# Altium schematic sheet NANO_STM32F103_2.SchDoc
size A4
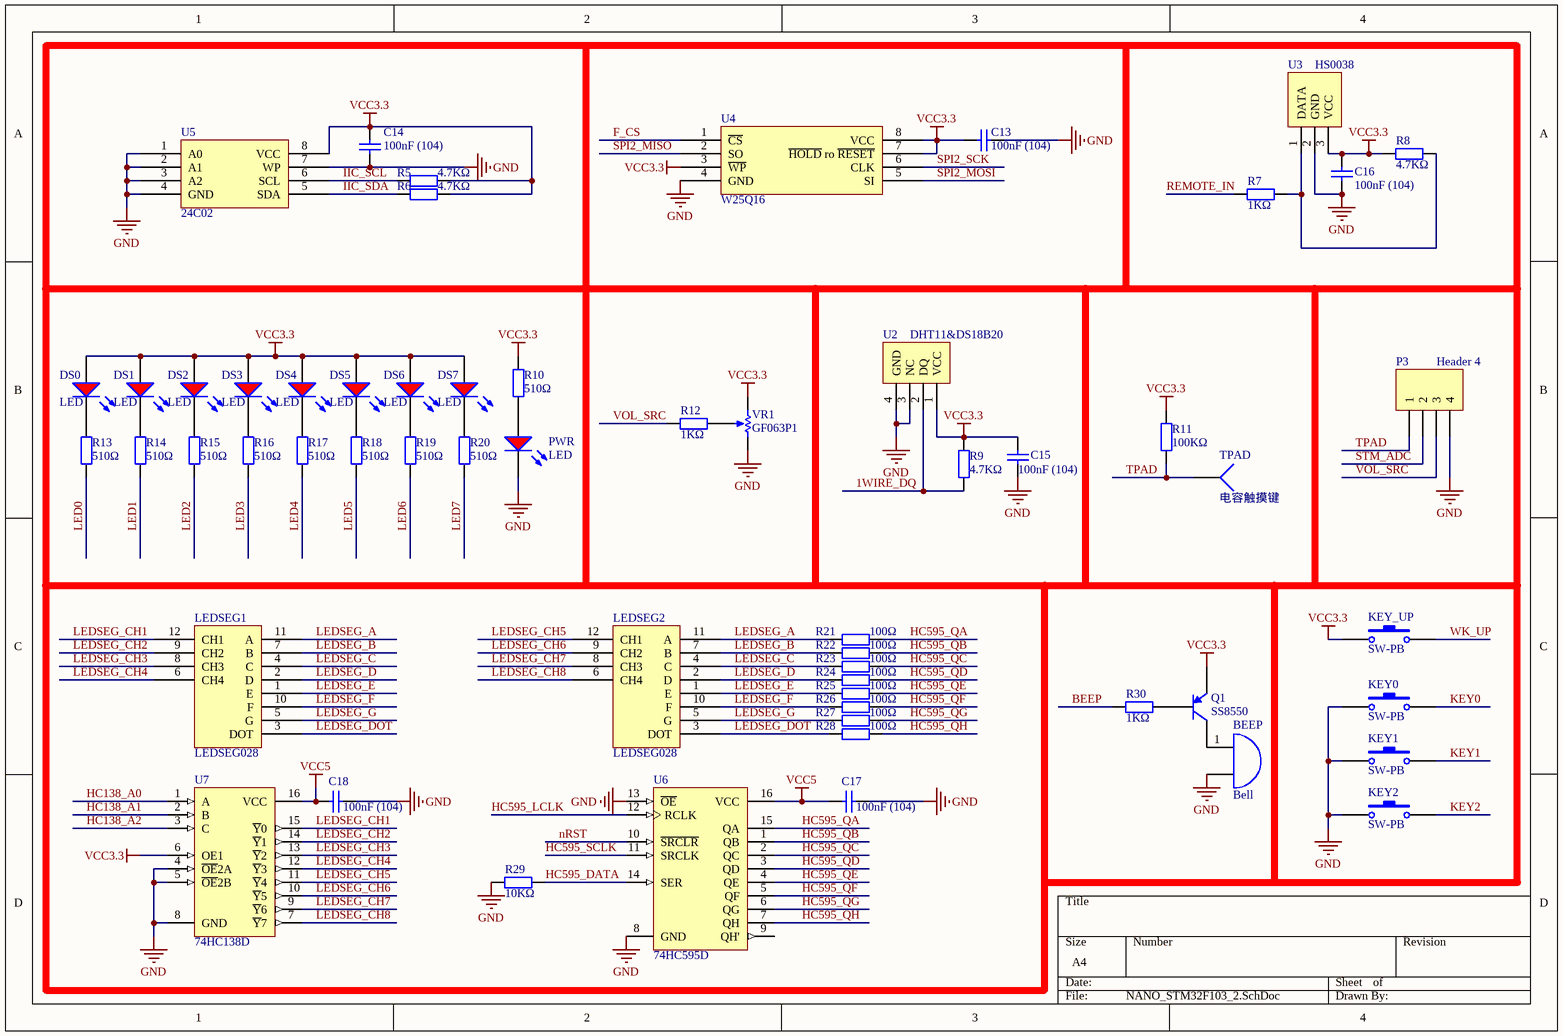
[diagram p0: NANO_STM32F103_2.SchDoc]

## Parts
BEEP  Bell  [PIN2]
C13  100nF (104)  [0603_C]
C14  100nF (104)  [0603_C]
C15  100nF (104)  [0603_C]
C16  100nF (104)  [0603_C]
C17  100nF (104)  [0603_C]
C18  100nF (104)  [0603_C]
DS0  LED  [0805_LED_S1]
DS1  LED  [0805_LED_S1]
DS2  LED  [0805_LED_S1]
DS3  LED  [0805_LED_S1]
DS4  LED  [0805_LED_S1]
DS5  LED  [0805_LED_S1]
DS6  LED  [0805_LED_S1]
DS7  LED  [0805_LED_S1]
KEY0  SW-PB  [SPST-2]
KEY1  SW-PB  [SPST-2]
KEY2  SW-PB  [SPST-2]
KEY_UP  SW-PB  [SPST-2]
LEDSEG1  LEDSEG028  [HDR1X12]
LEDSEG2  LEDSEG028  [HDR1X12]
P3  Header 4  [HDR1X4]
PWR  LED  [0805_LED_S1]
Q1  SS8550  [SOT-23(SOT-23-3)]
R5  4.7KΩ  [0603_R]
R6  4.7KΩ  [0603_R]
R7  1KΩ  [0603_R]
R8  4.7KΩ  [0603_R]
R9  4.7KΩ  [0603_R]
R10  510Ω  [0603_R]
R11  100KΩ  [0603_R]
R12  1KΩ  [0603_R]
R13  510Ω  [0603_R]
R14  510Ω  [0603_R]
R15  510Ω  [0603_R]
R16  510Ω  [0603_R]
R17  510Ω  [0603_R]
R18  510Ω  [0603_R]
R19  510Ω  [0603_R]
R20  510Ω  [0603_R]
R21  100Ω  [0603_R]
R22  100Ω  [0603_R]
R23  100Ω  [0603_R]
R24  100Ω  [0603_R]
R25  100Ω  [0603_R]
R26  100Ω  [0603_R]
R27  100Ω  [0603_R]
R28  100Ω  [0603_R]
R29  10KΩ  [0603_R]
R30  1KΩ  [0603_R]
TPAD  电容触摸键  [TPAD]
U2  DHT11&DS18B20  [DHT11&DS18B20]
U3  HS0038  [HS0038]
U4  W25Q16  [SOIC-8_208mil]
U5  24C02  [SOIC-8_150mil]
U6  74HC595D  [SOIC-16_150mil]
U7  74HC138D  [SOIC-16_150mil]
VR1  GF063P1  [VR5]

## Nets
GND: BEEP.2(B) C13.2 C14.1 C15.2 C16.2 C17.2 C18.2 KEY0.1 KEY1.1 KEY2.1 P3.4 PWR.K R29.1 U2.3(NC) U2.4(GND) U3.2(GND) U4.4(GND) U5.1(A0) U5.2(A1) U5.3(A2) U5.4(GND) U5.7(WP) U6.8(GND) U6.13(~{OE}) U7.4(~{OE}2A) U7.5(~{OE}2B) U7.8(GND) VR1.2(BOT)
VCC3.3: C13.1 C14.2 C15.1 C16.1 DS0.A DS1.A DS2.A DS3.A DS4.A DS5.A DS6.A DS7.A KEY_UP.1 Q1.2(E) R5.2 R6.2 R8.1 R9.2 R10.1 R11.1 U2.1(VCC) U3.3(VCC) U4.3(~{WP}) U4.7(~{HOLD}_ro_~{RESET}) U4.8(VCC) U5.8(VCC) U7.6(OE1) VR1.1(TOP)
VCC5: C17.1 C18.1 U6.16(VCC) U7.16(VCC)
1WIRE_DQ: R9.1 U2.2(DQ)
BEEP: R30.1
F_CS: U4.1(~{CS})
HC138_A0: U7.1(A)
HC138_A1: U7.2(B)
HC138_A2: U7.3(C)
HC595_DATA: R29.2 U6.14(SER)
HC595_LCLK: U6.12(RCLK)
HC595_QA: R21.2 U6.15(QA)
HC595_QB: R22.2 U6.1(QB)
HC595_QC: R23.2 U6.2(QC)
HC595_QD: R24.2 U6.3(QD)
HC595_QE: R25.2 U6.4(QE)
HC595_QF: R26.2 U6.5(QF)
HC595_QG: R27.2 U6.6(QG)
HC595_QH: R28.2 U6.7(QH)
HC595_SCLK: U6.11(SRCLK)
IIC_SCL: R5.1 U5.6(SCL)
IIC_SDA: R6.1 U5.5(SDA)
KEY0: KEY0.2
KEY1: KEY1.2
KEY2: KEY2.2
LED0: R13.2
LED1: R14.2
LED2: R15.2
LED3: R16.2
LED4: R17.2
LED5: R18.2
LED6: R19.2
LED7: R20.2
LEDSEG_A: LEDSEG1.11(A) LEDSEG2.11(A) R21.1
LEDSEG_B: LEDSEG1.7(B) LEDSEG2.7(B) R22.1
LEDSEG_C: LEDSEG1.4(C) LEDSEG2.4(C) R23.1
LEDSEG_CH1: LEDSEG1.12(CH1) U7.15(~{Y}0)
LEDSEG_CH2: LEDSEG1.9(CH2) U7.14(~{Y}1)
LEDSEG_CH3: LEDSEG1.8(CH3) U7.13(~{Y}2)
LEDSEG_CH4: LEDSEG1.6(CH4) U7.12(~{Y}3)
LEDSEG_CH5: LEDSEG2.12(CH1) U7.11(~{Y}4)
LEDSEG_CH6: LEDSEG2.9(CH2) U7.10(~{Y}5)
LEDSEG_CH7: LEDSEG2.8(CH3) U7.9(~{Y}6)
LEDSEG_CH8: LEDSEG2.6(CH4) U7.7(~{Y}7)
LEDSEG_D: LEDSEG1.2(D) LEDSEG2.2(D) R24.1
LEDSEG_DOT: LEDSEG1.3(DOT) LEDSEG2.3(DOT) R28.1
LEDSEG_E: LEDSEG1.1(E) LEDSEG2.1(E) R25.1
LEDSEG_F: LEDSEG1.10(F) LEDSEG2.10(F) R26.1
LEDSEG_G: LEDSEG1.5(G) LEDSEG2.5(G) R27.1
nRST: U6.10(~{SRCLR})
REMOTE_IN: R7.1
SPI2_MISO: U4.2(SO)
SPI2_MOSI: U4.5(SI)
SPI2_SCK: U4.6(CLK)
STM_ADC: P3.2
TPAD: P3.1 R11.2 TPAD.1
VOL_SRC: P3.3 R12.1
WK_UP: KEY_UP.2
NetBEEP_1: BEEP.1(A) Q1.3(C)
NetDS0_K: DS0.K R13.1
NetDS1_K: DS1.K R14.1
NetDS2_K: DS2.K R15.1
NetDS3_K: DS3.K R16.1
NetDS4_K: DS4.K R17.1
NetDS5_K: DS5.K R18.1
NetDS6_K: DS6.K R19.1
NetDS7_K: DS7.K R20.1
NetPWR_A: PWR.A R10.2
NetQ1_1: Q1.1(B) R30.2
NetR7_2: R7.2 R8.2 U3.1(DATA)
NetR12_2: R12.2 VR1.3(TAP)

Not connected (* = marked no-connect by the designer): U6 9(QH')

## Library data of the parts
BEEP = Bell: Electrical Bell; Published: 24-Mar-1999; LatestRevisionDate: 17-Jul-2002; LatestRevisionNote: Re-released for DXP Platform.; PackageReference: PIN2; Publisher: Altium Limited
C13-C18 = 0603 100nF (104) 10% 50V: 贴片电容; ComponentLink1Description: 供应商链接; ComponentLink1URL: http://www.szlcsc.com/product/details_15331.html; Package: 0603; Supplier: LC; SuppliersPartNumber: C14663
DS0-DS7 PWR = 0603 红灯: 发光二极管; ComponentLink1Description: 供应商链接; ComponentLink1URL: http://www.szlcsc.com/product/details_2659.html; Package: 0603; Supplier: LC; SuppliersPartNumber: C2286
KEY0-KEY2 KEY_UP = SW-PB: Switch; Published: 24-Mar-1999; LatestRevisionDate: 17-Jul-2002; LatestRevisionNote: Re-released for DXP Platform.; PackageReference: SPST-2; Publisher: Altium Limited; PackageDescription: Switch; 2 Leads
LEDSEG1 LEDSEG2 = LEDSEG028: 四位八段数码管_共阴极
P3 = Header 4: Header, 4-Pin; LatestRevisionDate: 17-Jul-2002; LatestRevisionNote: Re-released for DXP Platform.; Publisher: Altium Limited
Q1 = SOT-23 SS8550 Y2: PNP三极管; ComponentLink1Description: 供应商链接; ComponentLink1URL: http://www.szlcsc.com/product/details_9037.html; Package: SOT-23; Supplier: LC; SuppliersPartNumber: C8542
R5 R6 R8 R9 = 0603 4.7KΩ (4701) 1%: 贴片电阻; ComponentLink1Description: 供应商链接; ComponentLink1URL: http://www.szlcsc.com/product/details_23889.html; Package: 0603; Supplier: LC; SuppliersPartNumber: C23162
R7 R12 R30 = 0603 1KΩ (1001) 1%: 贴片电阻; ComponentLink1Description: 供应商链接; ComponentLink1URL: http://www.szlcsc.com/product/details_21904.html; Package: 0603; Supplier: LC; SuppliersPartNumber: C21190
R10 R13-R20 = 0603 510Ω (5100) 1%: 贴片电阻; ComponentLink1Description: 供应商链接; ComponentLink1URL: http://www.szlcsc.com/product/details_23920.html; Package: 0603; Supplier: LC; SuppliersPartNumber: C23193
R11 = 0603 100KΩ (1003) 1%: 贴片电阻; ComponentLink1Description: 供应商链接; ComponentLink1URL: http://www.szlcsc.com/product/details_26546.html; Package: 0603; Supplier: LC; SuppliersPartNumber: C25803
R21-R28 = 0603 100Ω (1000) 1%: 贴片电阻; ComponentLink1Description: 供应商链接; ComponentLink1URL: http://www.szlcsc.com/product/details_23502.html; Package: 0603; Supplier: LC; SuppliersPartNumber: C22775
R29 = 0603 10KΩ (1002) 1%: 贴片电阻; ComponentLink1Description: 供应商链接; ComponentLink1URL: http://www.szlcsc.com/product/details_26547.html; Package: 0603; Supplier: LC; SuppliersPartNumber: C25804
TPAD = Socket: LatestRevisionDate: 17-Jul-2002; LatestRevisionNote: Re-released for DXP Platform.; Publisher: Altium Limited
U2 = DHT11&DS18B20: DHT11或DS18B20_2.54mm
U3 = HS0038: HS0038_2.54mm
U4 = W25Q128FVSIG_[C35101]: Flash ROM; ComponentLink1Description: 供应商链接; ComponentLink1URL: http://www.szlcsc.com/product/details_36072.html; Package: SOIC-8; Supplier: LC; SuppliersPartNumber: C35101
U5 = CAN/TJA1050T/CM_[C6952]: ComponentLink1Description: 供应商链接; ComponentLink1URL: http://www.szlcsc.com/product/details_7424.html; Package: SOIC-8_150mil; Supplier: LC; SuppliersPartNumber: C6952
U6 = 74HC595D_[C5947]: 74系列逻辑芯片; ComponentLink1Description: 供应商链接; ComponentLink1URL: http://www.szlcsc.com/product/details_6413.html; Package: SOIC-16_150mil; Supplier: LC; SuppliersPartNumber: C5947
U7 = 74HC138D_[C5602]: 74系列逻辑芯片; ComponentLink1Description: 供应商链接; ComponentLink1URL: http://www.szlcsc.com/product/details_6053.html; Package: SOIC-16_150mil; Supplier: LC; SuppliersPartNumber: C5602
VR1 = RPot: 滑动变阻器; Sim Note: Enter the Resistance value and the set point into parameter fields.; Set Position: 0.5; Value: 1K; Published: 8-Jun-2000; LatestRevisionDate: 17-Jul-2002; LatestRevisionNote: Re-released for DXP Platform.; PackageReference: VR5; Publisher: Altium Limited; PackageDescription: Variable Resistor, Thru-Hole; 3 Leads